# Altium project Carrier_Board_Template.PrjPcb
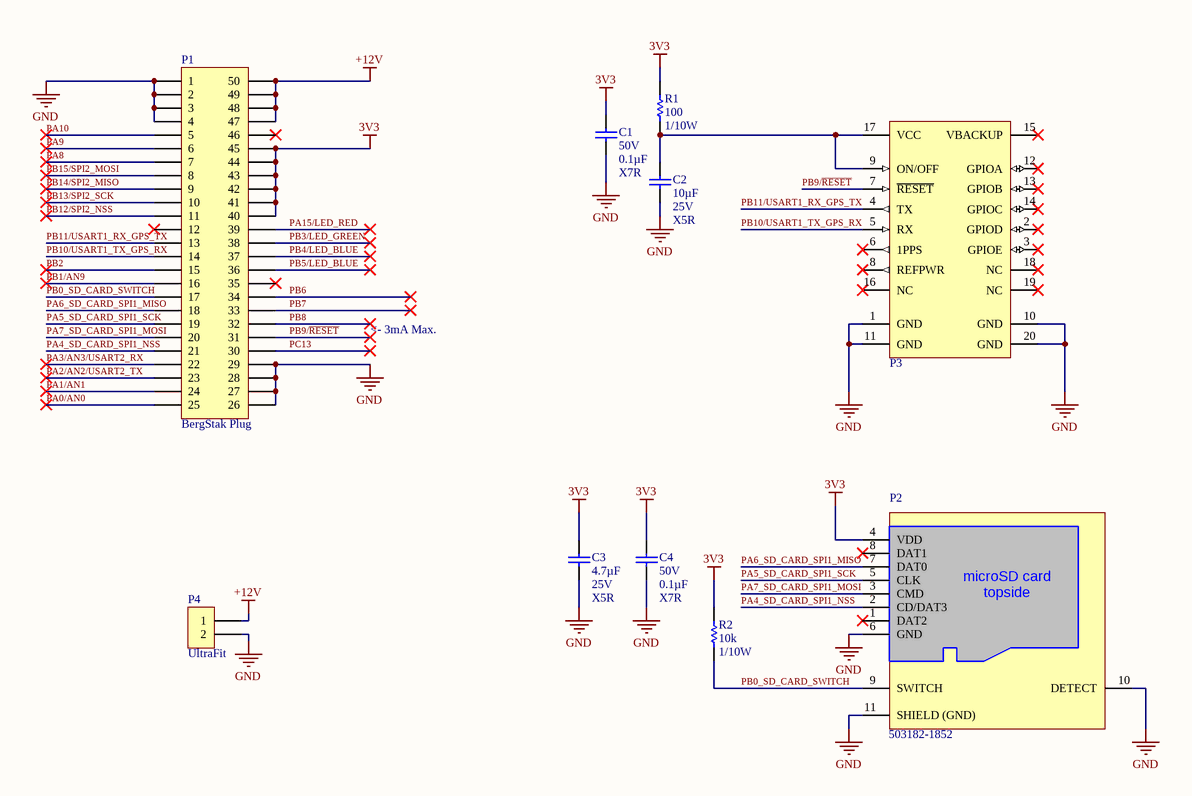
[diagram p0: Controller_Board_Interface.SchDoc]

1 sheet, 10 parts. Net scope: global (net labels, ports and power ports of the same name join across sheets).
Board file: Carrier_Board_Template.PcbDoc

## Sheet Controller_Board_Interface.SchDoc
size Letter; Website: www.uwmidsun.com

### Parts
C1  Voltage: 50V  Capacitance: 0.1µF  Temperature Coefficient: X7R  [CAP, 0603]  (hidden comment: CAP CER 0.1UF 50V 10% X7R 0603)
C2  Capacitance: 10µF  Voltage: 25V  Temperature Coefficient: X5R  [CAP, 0603]  (hidden comment: CAP CER 10uF 25V 20% X5R 0603)
C3  Capacitance: 4.7µF  Voltage: 25V  Temperature Coefficient: X5R  [CAP, 0603]  (hidden comment: CAP CER 4.7UF 25V 10% X5R 0603)
C4  Voltage: 50V  Capacitance: 0.1µF  Temperature Coefficient: X7R  [CAP, 0603]  (hidden comment: CAP CER 0.1UF 50V 10% X7R 0603)
P1  Series: BergStak Plug  [CONN, Bergstak 50 Pos Plug]  (hidden comment: CONN 50POS Bergstak Plug 0.02")
P2  Manufacturer Part Number: 503182-1852  [CONN MICRO-SD HOLDER MOLEX 503182-1852]  (hidden comment: CONN MICRO-SD ULTRA-LOW 8CKT)
P3  EVAL GPS EVM-GPS-F4  [EVM-GPS-F4]  (value not drawn)
P4  Series: UltraFit  [CONN, 2POS ULTRA-FIT]  (hidden comment: CONN 2POS ULTRA-FIT 0.138")
R1  Resistance: 100  Power: 1/10W  [RES, 0603]  (hidden comment: RES 100 OHM 1% 1/10W 0603)
R2  Resistance: 10k  Power: 1/10W  [RES, 0603]  (hidden comment: RES 10K OHM 1% 1/10W 0603)

### Nets
3V3: C1.2 C3.1 C4.2 P1.40 P1.41 P1.42 P1.43 P1.44 P1.45 P2.4(VDD) R1.1 R2.2
+12V: P1.47 P1.48 P1.49 P1.50 P4.1
GND: C1.1 C2.2 C3.2 C4.1 P1.1 P1.2 P1.3 P1.4 P1.26 P1.27 P1.28 P1.29 P2.6(GND) P2.10(DETECT) P2.11(SHIELD_(GND)) P3.1(GND) P3.10(GND) P3.11(GND) P3.20(GND) P4.2
PA0/AN0: P1.25
PA1/AN1: P1.24
PA2/AN2/USART2_TX: P1.23
PA3/AN3/USART2_RX: P1.22
PA4_SD_CARD_SPI1_NSS: P1.21 P2.2(CD/DAT3)
PA5_SD_CARD_SPI1_SCK: P1.19 P2.5(CLK)
PA6_SD_CARD_SPI1_MISO: P1.18 P2.7(DAT0)
PA7_SD_CARD_SPI1_MOSI: P1.20 P2.3(CMD)
PA8: P1.7
PA9: P1.6
PA10: P1.5
PA15/LED_RED: P1.39
PB0_SD_CARD_SWITCH: P1.17 P2.9(SWITCH) R2.1
PB1/AN9: P1.16
PB2: P1.15
PB3/LED_GREEN: P1.38
PB4/LED_BLUE: P1.37
PB5/LED_BLUE: P1.36
PB6: P1.34
PB7: P1.33
PB8: P1.32
PB9/~{RESET}: P1.31 P3.7(~{RESET})
PB10/USART1_TX_GPS_RX: P1.14 P3.5(RX)
PB11/USART1_RX_GPS_TX: P1.13 P3.4(TX)
PB12/SPI2_NSS: P1.11
PB13/SPI2_SCK: P1.10
PB14/SPI2_MISO: P1.9
PB15/SPI2_MOSI: P1.8
PC13: P1.30
NetC2_1: C2.1 P3.9(ON/OFF) P3.17(VCC) R1.2

Not connected (* = marked no-connect by the designer): P1 12* 35* 46*; P2 1(DAT2)* 8(DAT1)*; P3 2(GPIOD)* 3(GPIOE)* 6(1PPS)* 8(REFPWR)* 12(GPIOA)* 13(GPIOB)* 14(GPIOC)* 15(VBACKUP)* 16(NC)* 18(NC)* 19(NC)*

### Notes on the sheet
- <- 3mA Max.
- Project:
- Title:
- Size:
- Project Lead:
- Letter
- Revision:
- University of Waterloo
- 200 University Ave W
- Waterloo, ON, Canada
- N2L 3E9
- Date:
- Sheet
- of
- Website:
- (in symbol CONN MICRO-SD ULTRA-LOW 8CKT) microSD card / topside

### Library data of the parts
C1 C4 = CAP CER 0.1UF 50V 10% X7R 0603: 0.10µF ±10% 50V Ceramic Capacitor X7R 0603 (1608 Metric); Manufacturer 1: AVX Corporation; Manufacturer Part Number 1: 06035C104KAT2A; Supplier 1: Digi-Key; Supplier Part Number 1: 478-5052-1-ND; Packaging: Cut Tape (CT); Part Status: Active; Operating Temperature: -55°C ~ 125°C; Ratings: -; Mounting Type: Surface Mount, MLCC; Package / Case: 0603 (1608 Metric); Size / Dimension: 0.063" L x 0.032" W (1.60mm x 0.81mm); Height - Seated (Max): -; Thickness (Max): 0.035" (0.90mm); Lead Spacing: -; Lead Style: -; ComponentLink1URL: http://datasheets.avx.com/X7RDielectric.pdf; ComponentLink1Description: http://datasheets.avx.com/X7RDielectric.pdf; Tolerance: ±10%
C2 = CAP CER 10uF 25V 20% X5R 0603: 10µF ±20% 25V Ceramic Capacitor X5R 0603 (1608 Metric); Manufacturer 1: Murata Electronics North America; Manufacturer Part Number 1: GRM188R61E106MA73D; Supplier 1: Digi-Key; Supplier Part Number 1: 490-7202-1-ND; Packaging: Cut Tape (CT); Part Status: Active; Operating Temperature: -55°C ~ 85°C; Ratings: -; Mounting Type: Surface Mount, MLCC; Package / Case: 0603 (1608 Metric); Size / Dimension: 0.063" L x 0.031" W (1.60mm x 0.80mm); Height - Seated (Max): -; Thickness (Max): 0.031" (0.80mm); Lead Spacing: -; Lead Style: -; ComponentLink1URL: http://www.murata.com/~/media/webrenewal/support/library/catalog/products/capacitor/mlcc/c02e.ashx; ComponentLink1Description: http://www.murata.com/~/media/webrenewal/support/library/catalog/products/capacitor/mlcc/c02e.ashx; Tolerance: ±20%
C3 = CAP CER 4.7UF 25V 10% X5R 0603: 4.7µF ±10% 25V Ceramic Capacitor X5R 0603 (1608 Metric); Manufacturer 1: Murata Electronics North America; Manufacturer Part Number 1: GRM188R61E475KE11D; Supplier 1: Digi-Key; Supplier Part Number 1: 490-7203-1-ND; Packaging: Cut Tape (CT); Part Status: Active; Operating Temperature: -55°C ~ 85°C; Ratings: -; Mounting Type: Surface Mount, MLCC; Package / Case: 0603 (1608 Metric); Size / Dimension: 0.063" L x 0.031" W (1.60mm x 0.80mm); Height - Seated (Max): -; Thickness (Max): 0.031" (0.80mm); Lead Spacing: -; Lead Style: -; ComponentLink1URL: http://www.murata.com/~/media/webrenewal/support/library/catalog/products/capacitor/mlcc/c02e.ashx; ComponentLink1Description: http://www.murata.com/~/media/webrenewal/support/library/catalog/products/capacitor/mlcc/c02e.ashx; Tolerance: ±10%
P1 = CONN 50POS Bergstak Plug 0.02": 50 Position Connector Plug, Outer Shroud Contacts Surface Mount Gold; Manufacturer 1: Amphenol FCI; Manufacturer Part Number 1: 10132797-055100LF; Number of Positions: 50; Mated Stacking Heights: 5mm; Pitch: 0.020" (0.50mm); Supplier 1: Digi-Key; Supplier Part Number 1: 609-5226-1-ND; Packaging: Cut Tape (CT); Part Status: Active; Connector Type: Plug, Outer Shroud Contacts; Number of Rows: 2; Mounting Type: Surface Mount; Contact Finish: Gold; Contact Finish Thickness: 1µin (0.025µm); Height Above Board: 0.169" (4.30mm); ComponentLink1URL: http://portal.fciconnect.com/Comergent//fci/drawing/10132797.pdf; ComponentLink1Description: http://portal.fciconnect.com/Comergent//fci/drawing/10132797.pdf
P2 = CONN MICRO-SD ULTRA-LOW 8CKT: 9 (8 + 1) Position Card Connector microSD™ Surface Mount, Right Angle Gold /; Manufacturer: Molex; Gender: Male; Number of Circuits: 8; Pitch: 1.1mm; Supplier 1: Digi-Key; RoHS: Yes; Stock 1: 36042; Pricing 1: 1 = 2.45000, 10 = 2.22400, 25 = 2.08840, 50 = 1.99740, 100 = 1.90670, 250 = 1.72508, 500 = 1.58890 (USD); Mount: Surface Mount; Contact Material: Copper Alloy; Contact Plating: Gold; Housing Material: Polymer; Min Operating Temperature: -25°C; Max Operating Temperature: 85°C; Number of Rows: 1; Package Quantity: 1600; Packaging: Tape and Reel; Connector Type: Connector; Termination: Solder; Orientation: Right Angle; Length: 15.2mm; Depth: 14.95mm; REACH SVHC: No SVHC; Halogen Free: Low Halogen; Supplier Part Number 1: WM12834CT-ND
P3 = EVAL GPS EVM-GPS-F4: BOARD EVAL FOR RXM-GPS-F4; Manufacturer 1: Linx Technologies Inc.; Frequency: 1575.42MHz; Supplier 1: Digi-Key; Supplier Part Number 1: EVM-GPS-F4-ND; Manufacturer Part Number 1: EVM-GPS-F4; Part Status: Active; Type: GPS; For Use With/Related Products: RXM-GPS-F4; Supplied Contents: Board; ComponentLink1URL: https://www.linxtechnologies.com/resources/data-guides/man-evm-gps-f4.pdf; ComponentLink1Description: https://www.linxtechnologies.com/resources/data-guides/man-evm-gps-f4.pdf
P4 = CONN 2POS ULTRA-FIT 0.138": 2 Positions Header, Shrouded Connector 0.138" (3.50mm) Through Hole Gold; Manufacturer 1: Molex, LLC; Manufacturer Part Number 1: 1722861302; Style: Board to Board or Cable; Shrouding: Shrouded - 4 Wall; Number of Positions: 2; Number of Positions Loaded: All; Contact Length - Post: 0.126" (3.20mm); Material Flammability Rating: UL94 V-0; Mated Stacking Heights: 26.99mm; Voltage: 400V; Supplier 1: Digi-Key; Supplier Part Number 1: WM11673-ND; Packaging: Tray; Part Status: Active; Connector Type: Header; Contact Type: Male Pin; Pitch - Mating: 0.138" (3.50mm); Number of Rows: 1; Row Spacing - Mating: -; Mounting Type: Through Hole; Termination: Kinked Pin, Solder; Fastening Type: Latch Holder; Contact Length - Mating: -; Overall Contact Length: -; Insulation Height: 0.465" (11.80mm); Contact Shape: Square; Contact Finish - Mating: Gold; Contact Finish Thickness - Mating: 30µin (0.76µm); Contact Finish - Post: Tin; Contact Material: Copper Alloy; Insulation Material: Liquid Crystal Polymer (LCP); Operating Temperature: -40°C ~ 120°C; Ingress Protection: -; Insulation Color: Black; Current Rating: -; Contact Finish Thickness - Post: 60µin (1.52µm); ComponentLink1URL: http://www.molex.com/pdm_docs/sd/1722861302_sd.pdf; ComponentLink1Description: http://www.molex.com/pdm_docs/sd/1722861302_sd.pdf
R1 = RES 100 OHM 1% 1/10W 0603: 100 Ohm ±1% 0.1W, 1/10W Chip Resistor 0603 (1608 Metric) Moisture Resistant Thick Film; Manufacturer 1: Yageo; Manufacturer Part Number 1: RC0603FR-07100RL; Temperature Coefficient: ±100ppm/°C; Supplier 1: Digi-Key; Supplier Part Number 1: 311-100HRCT-ND; Packaging: Cut Tape (CT); Part Status: Active; Composition: Thick Film; Operating Temperature: -55°C ~ 155°C; Package / Case: 0603 (1608 Metric); Supplier Device Package: 0603; Size / Dimension: 0.063" L x 0.031" W (1.60mm x 0.80mm); Height - Seated (Max): 0.022" (0.55mm); Failure Rate: -; ComponentLink1URL: http://www.yageo.com/documents/recent/PYu-RC_Group_51_RoHS_L_7.pdf; ComponentLink1Description: http://www.yageo.com/documents/recent/PYu-RC_Group_51_RoHS_L_7.pdf; Tolerance: ±1%
R2 = RES 10K OHM 1% 1/10W 0603: RES SMD 10K OHM 1% 1/10W 0603; Manufacturer 1: Yageo; Manufacturer Part Number 1: RC0603FR-0710KL; Temperature Coefficient: ±100ppm/°C; Supplier 1: Digi-Key; Supplier Part Number 1: 311-10.0KHRCT-ND; Packaging: Cut Tape (CT); Part Status: Active; Composition: Thick Film; Operating Temperature: -55°C ~ 155°C; Package / Case: 0603 (1608 Metric); Supplier Device Package: 0603; Size / Dimension: 0.063" L x 0.031" W (1.60mm x 0.80mm); Height - Seated (Max): 0.022" (0.55mm); Failure Rate: -; ComponentLink1URL: http://www.yageo.com/documents/recent/PYu-RC_Group_51_RoHS_L_7.pdf; ComponentLink1Description: http://www.yageo.com/documents/recent/PYu-RC_Group_51_RoHS_L_7.pdf; Tolerance: ±1%